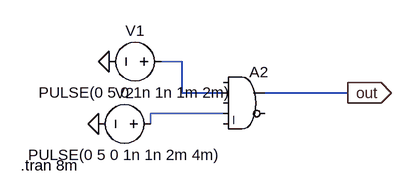
[diagram p0: schematic andgate.asc]
andgate.asc, the LTspice schematic file:
Version 4
SHEET 1 880 680
WIRE 0 -32 -32 -32
WIRE 0 16 0 -32
WIRE 64 16 0 16
WIRE 256 16 128 16
WIRE 64 48 -48 48
WIRE -48 64 -48 48
FLAG -112 -32 0
FLAG -128 64 0
FLAG 256 16 out
IOPIN 256 16 Out
SYMBOL voltage -16 -32 R90
WINDOW 0 -32 56 VBottom 2
WINDOW 3 32 56 VTop 2
WINDOW 123 0 0 Left 0
WINDOW 39 0 0 Left 0
SYMATTR InstName V1
SYMATTR Value PULSE(0 5 0 1n 1n 1m 2m)
SYMBOL voltage -32 64 R90
WINDOW 0 -32 56 VBottom 2
WINDOW 3 32 56 VTop 2
WINDOW 123 0 0 Left 0
WINDOW 39 0 0 Left 0
SYMATTR InstName V2
SYMATTR Value PULSE(0 5 0 1n 1n 2m 4m)
SYMBOL Digital\\and 96 -32 R0
SYMATTR InstName A2
TEXT -248 128 Left 2 !.tran 8m

The netlist it stands for:
* andgate.asc
V1 N001 0 PULSE(0 5 0 1n 1n 1m 2m)
V2 N002 0 PULSE(0 5 0 1n 1n 2m 4m)
A2 0 N001 0 N002 0 0 out 0 AND
.tran 8m
.backanno
.end